# Altium schematic sheet Connectors.SchDoc: Connectors
size Letter; Date: 2017-02-17; Revision: A; SheetNumber: 10; SheetTotal: 11; ProjectTitle: PDUv17: Power Distribution Unit
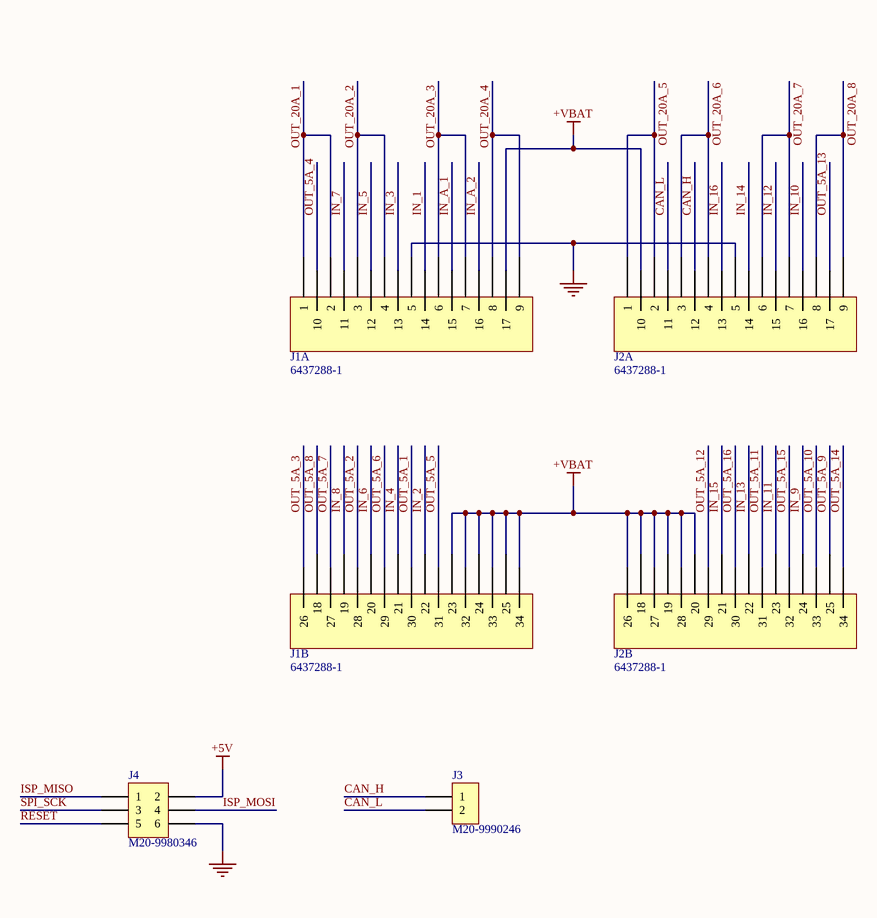
[diagram p0: Connectors.SchDoc]

## Parts
J1  6437288-1  [6437288-1]  (parts A,B of 2)
J2  6437288-1  [6437288-1]  (parts A,B of 2)
J3  M20-9990246  [M20-9990246]
J4  M20-9980346  [M20-9980346]

## Nets
+5V: J4.2
+VBAT: J1.17 J1.23 J1.24 J1.25 J1.32 J1.33 J1.34 J2.10 J2.18 J2.19 J2.20 J2.26 J2.27 J2.28
GND: J1.5 J2.5 J4.6
CAN_H: J2.12 J3.1
CAN_L: J2.11 J3.2
IN_1: J1.14
IN_2: J1.22
IN_3: J1.13
IN_4: J1.21
IN_5: J1.12
IN_6: J1.20
IN_7: J1.11
IN_8: J1.19
IN_9: J2.24
IN_10: J2.16
IN_11: J2.23
IN_12: J2.15
IN_13: J2.22
IN_14: J2.14
IN_15: J2.21
IN_16: J2.13
IN_A_1: J1.15
IN_A_2: J1.16
ISP_MISO: J4.1
ISP_MOSI: J4.4
OUT_5A_1: J1.30
OUT_5A_2: J1.28
OUT_5A_3: J1.26
OUT_5A_4: J1.10
OUT_5A_5: J1.31
OUT_5A_6: J1.29
OUT_5A_7: J1.27
OUT_5A_8: J1.18
OUT_5A_9: J2.25
OUT_5A_10: J2.33
OUT_5A_11: J2.31
OUT_5A_12: J2.29
OUT_5A_13: J2.17
OUT_5A_14: J2.34
OUT_5A_15: J2.32
OUT_5A_16: J2.30
OUT_20A_1: J1.1 J1.2
OUT_20A_2: J1.3 J1.4
OUT_20A_3: J1.6 J1.7
OUT_20A_4: J1.8 J1.9
OUT_20A_5: J2.1 J2.2
OUT_20A_6: J2.3 J2.4
OUT_20A_7: J2.6 J2.7
OUT_20A_8: J2.8 J2.9
~{RESET}: J4.5
SPI_SCK: J4.3

## Notes on the sheet
- Date:
- Revision:
- Sheet:
- /

## Library data of the parts
J1 J2 = 6437288-1: Superseal 34-way right angle PCB header
J3 = M20-9990246: 2.54mm Header 1x2-Pin; Supplier 1: Digi-Key; Supplier Part Number 1: 952-2262-ND
J4 = M20-9980346: 2.54mm Header 2x3-Pin; Supplier 1: Digi-Key; Supplier Part Number 1: 952-2121-ND